# Altium project MISKO3 1.0 shield.PrjPcb
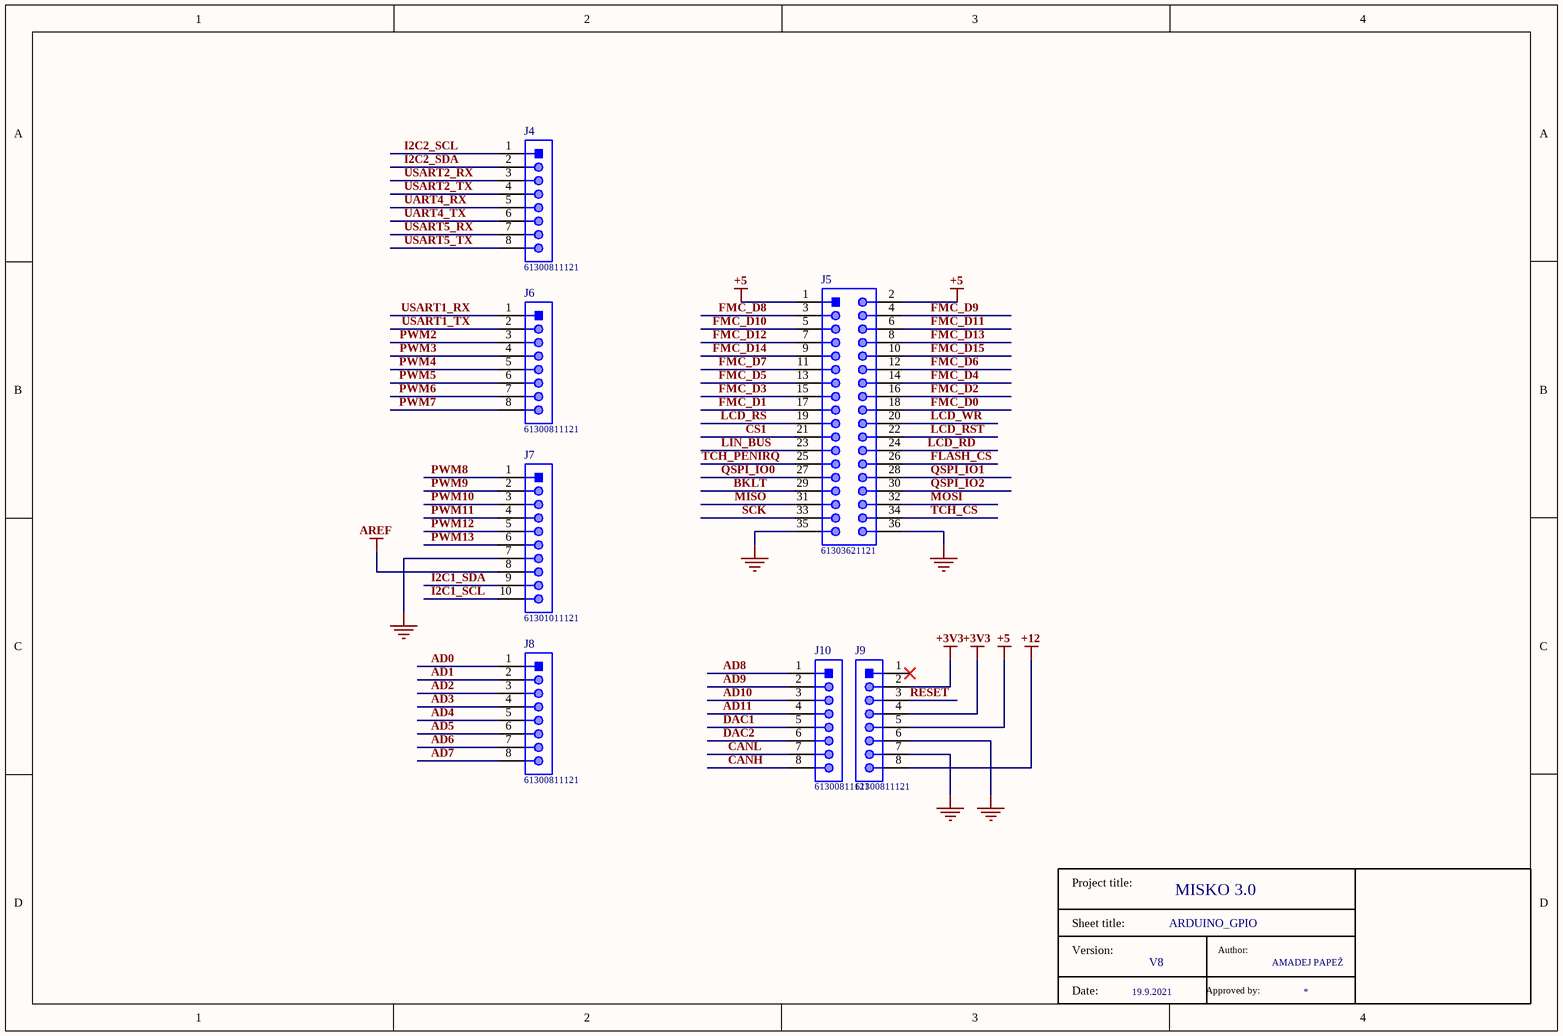
[diagram p0: ARDUINO_GPIO.SchDoc]
1 sheet, 8 parts. Net scope: hierarchical (ports join the sheet entries above them; power ports are global).
Board file: Misko 3 1.0 shield.PcbDoc

## Sheet ARDUINO_GPIO.SchDoc: MISKO 3.0
size A4; Date: 19.9.2021; Author: AMADEJ PAPEŽ; SheetNumber: 1; SheetTotal: 1; Version: V8; SheetTitle: ARDUINO_GPIO

### Parts
J4  61300811121  [61300811121]
J5  61303621121  [61303621121]
J6  61300811121  [61300811121]
J7  61301011121  [61301011121]
J8  61300811121  [61300811121]
J9  61300811121  [61300811121]
J10  61300811121  [61300811121]
T6  (no value)

### Nets
+3V3: J9.2 J9.4
+5: J5.1 J5.2 J9.5
+12: J9.8
AREF: J7.8
GND: J5.35 J5.36 J7.7 J9.6 J9.7
AD0: J8.1  [project net AD0_1]
AD1: J8.2  [project net AD1_1]
AD2: J8.3  [project net AD2_1]
AD3: J8.4  [project net AD3_1]
AD4: J8.5  [project net AD4_1]
AD5: J8.6  [project net AD5_1]
AD6: J8.7  [project net AD6_1]
AD7: J8.8  [project net AD7_1]
AD8: J10.1  [project net AD8_1]
AD9: J10.2  [project net AD9_1]
AD10: J10.3  [project net AD10_1]
AD11: J10.4  [project net AD11_1]
BKLT: J5.29  [project net BKLT_1]
CANH: J10.8  [project net CANH_1]
CANL: J10.7  [project net CANL_1]
CS1: J5.21  [project net CS1_1]
DAC1: J10.5  [project net DAC1_1]
DAC2: J10.6  [project net DAC2_1]
FLASH_CS: J5.26  [project net FLASH_CS_1]
FMC_D0: J5.18  [project net FMC_D0_1]
FMC_D1: J5.17  [project net FMC_D1_1]
FMC_D2: J5.16  [project net FMC_D2_1]
FMC_D3: J5.15  [project net FMC_D3_1]
FMC_D4: J5.14  [project net FMC_D4_1]
FMC_D5: J5.13  [project net FMC_D5_1]
FMC_D6: J5.12  [project net FMC_D6_1]
FMC_D7: J5.11  [project net FMC_D7_1]
FMC_D8: J5.3  [project net FMC_D8_1]
FMC_D9: J5.4  [project net FMC_D9_1]
FMC_D10: J5.5  [project net FMC_D10_1]
FMC_D11: J5.6  [project net FMC_D11_1]
FMC_D12: J5.7  [project net FMC_D12_1]
FMC_D13: J5.8  [project net FMC_D13_1]
FMC_D14: J5.9  [project net FMC_D14_1]
FMC_D15: J5.10  [project net FMC_D15_1]
I2C1_SCL: J7.10  [project net I2C1_SCL_1]
I2C1_SDA: J7.9  [project net I2C1_SDA_1]
I2C2_SCL: J4.1  [project net I2C2_SCL_1]
I2C2_SDA: J4.2  [project net I2C2_SDA_1]
LCD_RD: J5.24  [project net LCD_RD_1]
LCD_RS: J5.19  [project net LCD_RS_1]
LCD_RST: J5.22  [project net LCD_RST_1]
LCD_WR: J5.20  [project net LCD_WR_1]
LIN_BUS: J5.23  [project net LIN_BUS_1]
MISO: J5.31  [project net MISO_1]
MOSI: J5.32  [project net MOSI_1]
PWM2: J6.3  [project net PWM2_1]
PWM3: J6.4  [project net PWM3_1]
PWM4: J6.5  [project net PWM4_1]
PWM5: J6.6  [project net PWM5_1]
PWM6: J6.7  [project net PWM6_1]
PWM7: J6.8  [project net PWM7_1]
PWM8: J7.1  [project net PWM8_1]
PWM9: J7.2  [project net PWM9_1]
PWM10: J7.3  [project net PWM10_1]
PWM11: J7.4  [project net PWM11_1]
PWM12: J7.5  [project net PWM12_1]
PWM13: J7.6  [project net PWM13_1]
QSPI_IO0: J5.27  [project net QSPI_IO0_1]
QSPI_IO1: J5.28  [project net QSPI_IO1_1]
QSPI_IO2: J5.30  [project net QSPI_IO2_1]
RESET: J9.3  [project net RESET_1]
SCK: J5.33  [project net SCK_1]
TCH_CS: J5.34  [project net TCH_CS_1]
TCH_PENIRQ: J5.25  [project net TCH_PENIRQ_1]
UART4_RX: J4.5  [project net UART4_RX_1]
UART4_TX: J4.6  [project net UART4_TX_1]
USART1_RX: J6.1  [project net USART1_RX_1]
USART1_TX: J6.2  [project net USART1_TX_1]
USART2_RX: J4.3  [project net USART2_RX_1]
USART2_TX: J4.4  [project net USART2_TX_1]
USART5_RX: J4.7  [project net USART5_RX_1]
USART5_TX: J4.8  [project net USART5_TX_1]

Not connected (* = marked no-connect by the designer): J9 1*

### Notes on the sheet
- (in symbol Title block) Project title:; Sheet title:; Version:; Author:; Date:; Approved by:

### Library data of the parts
J4 J6 J8-J10 = CMP-1502-01076-1: THT Vertical Pin Header WR-PHD, Pitch 2.54 mm, Single Row, 8 pins; Manufacturer: Wurth Elektronik; Rated Current: 3A; Pin Number: 8; Working Voltage: 250VAC; Gender: Male; Contact Resistance: 20mOhm; Pitch: 2.54mm; Withstanding Voltage: 500VAC; Publisher: WurthElektronik; Operating Temperature: -40to105degC; Orientation: Vertical; Row Number: Single; Part Number: 61300811121; Package Reference: 61300811121; Mounting Technology: THT; Packaging: Bag; Manufacturer URL: http://www.we-online.de; Datasheet URL: https://katalog.we-online.de/em/datasheet/6130xx11121.pdf
J5 = CMP-1502-01131-1: THT Vertical Pin Header WR-PHD, Pitch 2.54 mm, Dual Row, 36 pins; Manufacturer: Wurth Elektronik; Gender: Male; Working Voltage: 250VAC; Pin Number: 36; Pitch: 2.54mm; Contact Resistance: 20mOhm; Rated Current: 3A; Withstanding Voltage: 500VAC; Row Number: Dual; Package Reference: 61303621121; Publisher: WurthElektronik; Datasheet URL: https://katalog.we-online.de/em/datasheet/6130xx21121.pdf; Part Number: 61303621121; Mounting Technology: THT; Manufacturer URL: http://www.we-online.de; Packaging: Bag; Orientation: Vertical; Operating Temperature: -40to105degC
J7 = CMP-1502-01082-1: THT Vertical Pin Header WR-PHD, Pitch 2.54 mm, Single Row, 10 pins; Manufacturer: Wurth Elektronik; Contact Resistance: 20mOhm; Rated Current: 3A; Pitch: 2.54mm; Gender: Male; Pin Number: 10; Working Voltage: 250VAC; Withstanding Voltage: 500VAC; Manufacturer URL: http://www.we-online.de; Operating Temperature: -40to105degC; Datasheet URL: https://katalog.we-online.de/em/datasheet/6130xx11121.pdf; Row Number: Single; Orientation: Vertical; Part Number: 61301011121; Packaging: Bag; Package Reference: 61301011121; Mounting Technology: THT; Publisher: WurthElektronik
T6 = Title block